# EAGLE design tinyape (EAGLE 9.1.1)
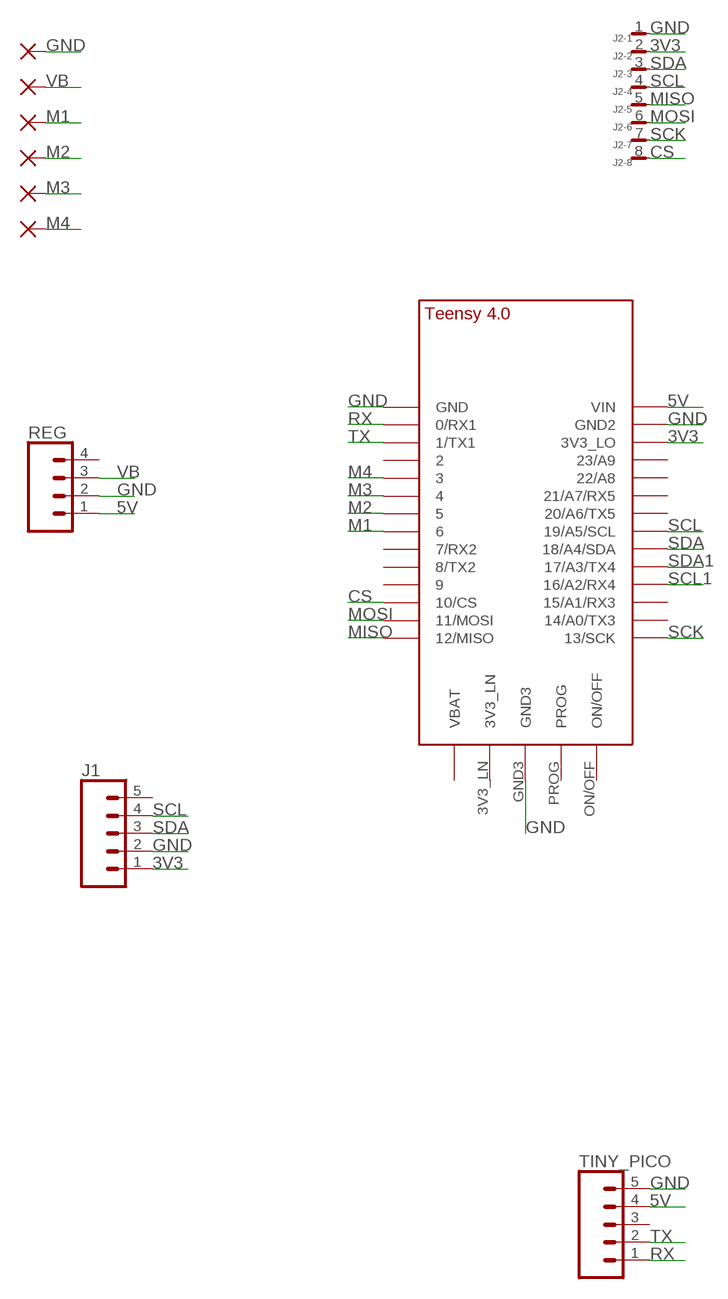
[diagram p0: schematic, sheet 1]

## Parts
GND  SMD2  [SMD1,27-2,54]
J1  CONN_05NO_SILK  [1X05_NO_SILK]
J2  JST-SH-8_RA  [SM08B-SRSS-TB]
M1  SMD2  [SMD1,27-2,54]
M2  SMD2  [SMD1,27-2,54]
M3  SMD2  [SMD1,27-2,54]
M4  SMD2  [SMD1,27-2,54]
REG  CONN_041X04_NO_SILK  [1X04_NO_SILK]
TINY_PICO  CONN_05NO_SILK  [1X05_NO_SILK]
U$1  TEENSY_4.0  [TEENSY_4.0]
VBAT  SMD2  [SMD1,27-2,54]

## Nets
3V3: J1.1 J2.2 U$1.3V3_LO
5V: REG.1 TINY_PICO.4 U$1.VIN
CS: J2.8 U$1.10/CS
GND: GND.1(P) J1.2 J2.1 REG.2 TINY_PICO.5 U$1.GND U$1.GND2 U$1.GND3
M1: M4.1(P) U$1.6
M2: M3.1(P) U$1.5
M3: M2.1(P) U$1.4/CANRX
M4: M1.1(P) U$1.3/CANTX
MISO: J2.5 U$1.12/MISO
MOSI: J2.6 U$1.11/MOSI
RX: TINY_PICO.1 U$1.0/RX(0/RX1)
SCK: J2.7 U$1.13/SCK
SCL: J1.4 J2.4 U$1.19/A5/SCL
SCL1: U$1.16/A2(16/A2/RX4)
SDA: J1.3 J2.3 U$1.18/A4/SDA
SDA1: U$1.17/A3(17/A3/TX4)
TX: TINY_PICO.2 U$1.1/TX(1/TX1)
VB: REG.3 VBAT.1(P)
Unconnected: J1.5 J2.M1 J2.M2 REG.4 TINY_PICO.3 U$1.2 U$1.3V3_LN U$1.7(7/RX2) U$1.8(8/TX2) U$1.9/CS U$1.14/A0(14/A0/TX3) U$1.15/A1(15/A1/RX3) U$1.20/A6(20/A6/TX5) U$1.21/A7(21/A7/RX5) U$1.22/A8 U$1.23/A9 U$1.ON/OFF U$1.PROG U$1.VBAT\(VBAT)

## Library data of the parts
GND M1-M4 VBAT = wirepad:SMD2: SMD PAD
J1 TINY_PICO = SparkFun-Connectors:CONN_05: Multi connection point. Often used as Generic Header-pin footprint for 0.1 inch spaced/style header connections On any of the 0.1 inch spaced packages, you can populate with these: Break Away Headers - Straight <https://www.sparkfun.com/products/116> (PRT-00116) Break Away Male Headers - Right Angle <https://www.sparkfun.com/products/553> (PRT-00553) Female Headers <https://www.sparkfun.com/products/115> (PRT-00115) Break Away Headers - Machine Pin <https://www.sparkfun.com/products/117> (PRT-00117) Break Away Female Headers - Swiss Machine Pin <https://www.sparkfun.com/products/743> (PRT-00743) For SCREWTERMINALS and SPRING TERMINALS visit here: Screw Terimnals on SparkFun.com <https://www.sparkfun.com/search/results?term=Screw+Terminals> (5mm/3.5mm/2.54mm spacing) This device is also useful as a general connection point to wire up your design to another part of your project. Our various solder wires solder well into these plated through hole pads. Hook-Up Wire - Assortment (Stranded, 22 AWG) <https://www.sparkfun.com/products/11375> (PRT-11375) Hook-Up Wire - Assortment (Solid Core, 22 AWG) <https://www.sparkfun.com/products/11367> (PRT-11367) View the entire wire category on our website here <https://www.sparkfun.com/categories/141> Special notes: Molex polarized connector foot print use with SKU : PRT-08231 with associated crimp pins and housings. 1MM SMD Version SKU: PRT-10208
J2 = con-JST-SH:JST-SH-8; MF: JST; MPN: SM08B-SRSS-TB
REG = SparkFun-Connectors:CONN_04: Multi connection point. Often used as Generic Header-pin footprint for 0.1 inch spaced/style header connections On any of the 0.1 inch spaced packages, you can populate with these: Break Away Headers - Straight <https://www.sparkfun.com/products/116> (PRT-00116) Break Away Male Headers - Right Angle <https://www.sparkfun.com/products/553> (PRT-00553) Female Headers <https://www.sparkfun.com/products/115> (PRT-00115) Break Away Headers - Machine Pin <https://www.sparkfun.com/products/117> (PRT-00117) Break Away Female Headers - Swiss Machine Pin <https://www.sparkfun.com/products/743> (PRT-00743) For SCREWTERMINALS and SPRING TERMINALS visit here: Screw Terimnals on SparkFun.com <https://www.sparkfun.com/search/results?term=Screw+Terminals> (5mm/3.5mm/2.54mm spacing) This device is also useful as a general connection point to wire up your design to another part of your project. Our various solder wires solder well into these plated through hole pads. Hook-Up Wire - Assortment (Stranded, 22 AWG) <https://www.sparkfun.com/products/11375> (PRT-11375) Hook-Up Wire - Assortment (Solid Core, 22 AWG) <https://www.sparkfun.com/products/11367> (PRT-11367) View the entire wire category on our website here <https://www.sparkfun.com/categories/141> Special notes: Molex polarized connector foot print use with SKU : PRT-08231 with associated crimp pins and housings. 1MM SMD Version SKU: PRT-10208; PROD_ID: CONN-09696
U$1 = TEENSY 4.0:TEENSY_4.0

## Board
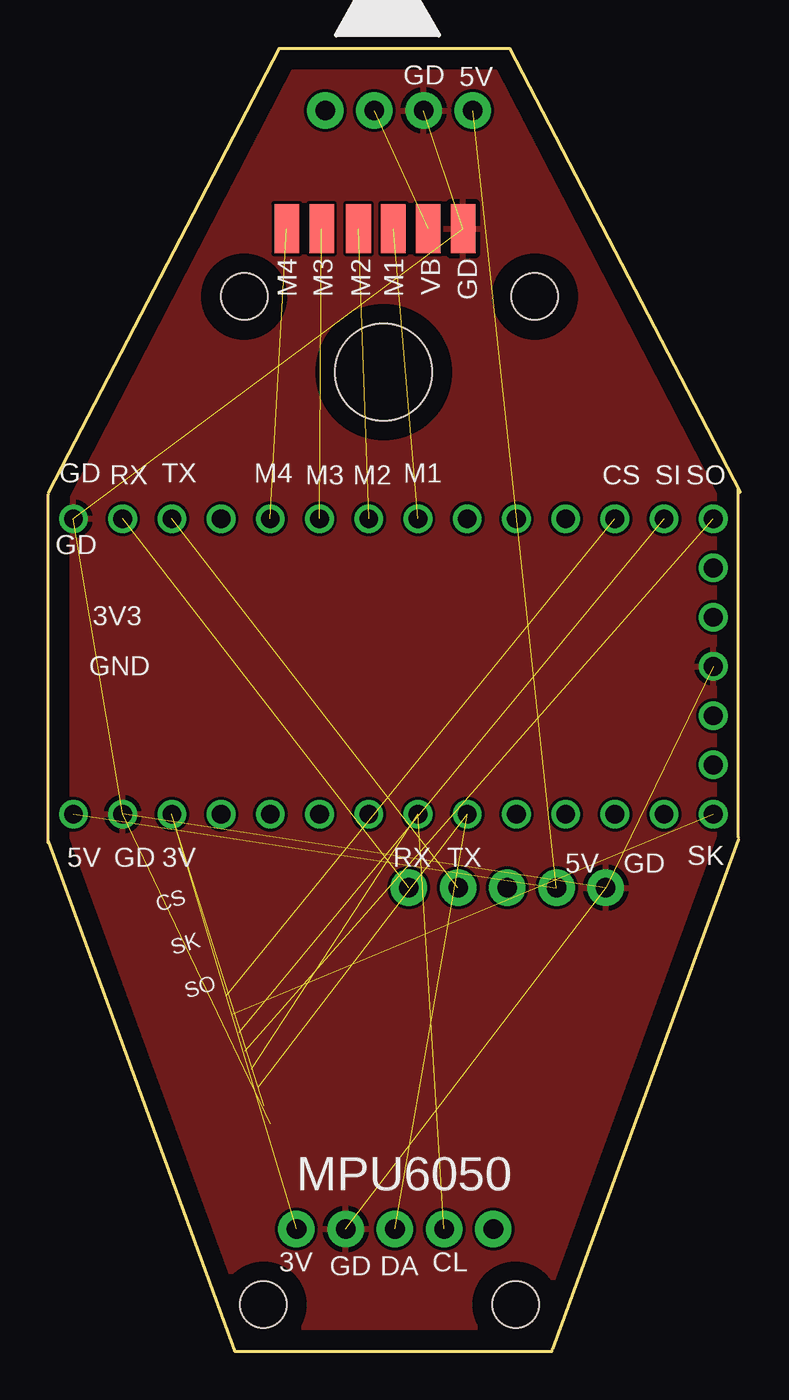
[diagram p1: board, top side]
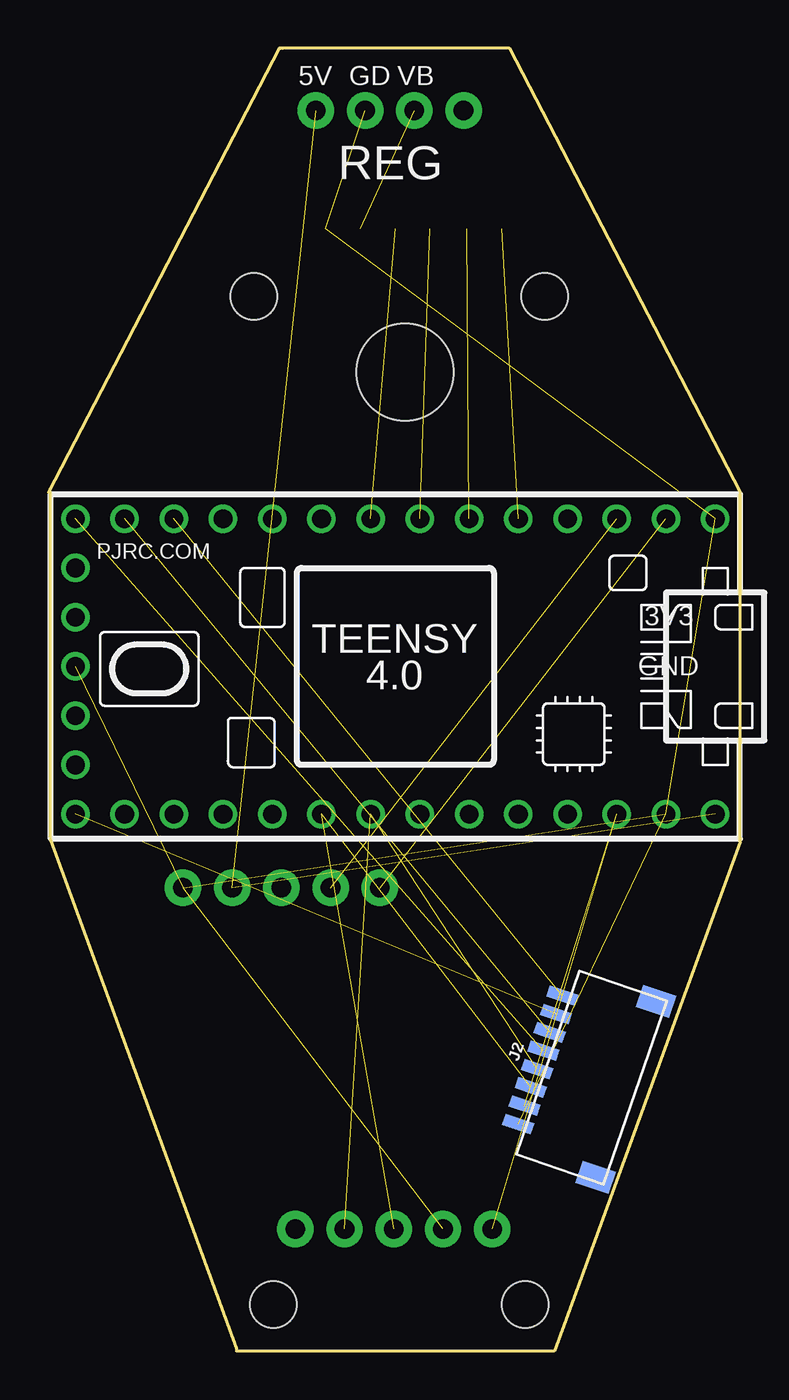
[diagram p2: board, bottom side, seen from below]

Size 35.7 x 67.2 mm. Coordinates in mm from the lower left corner, seen from the top.
Outline: 0,26.3 9.6,0 26,0
Outline: 0,26.2 0,44.2
Outline: 35.6,26.5 35.6,44.5
Outline: 0,44.3 11.9,67.2 23.6,67.2
Outline: 35.7,44.3 23.8,67.2 23.6,67.2
Outline: 23.6,67.2 23.7,67.2
Outline: 35.6,26.4 26,0.1
Copper layers (1*16): Top 0.035mm / dielectric 1.5mm / Bottom 0.035mm
Design rules "default": minimum track width 6mil, minimum drill 0.35mm, track to track 6mil, track to pad 6mil, pad to pad 6mil, via to via 6mil, smd to smd 6mil, copper to edge 40mil, drill to drill 6mil, minimum pad ring 10mil, minimum via ring 8mil, stop-mask expansion 4mil, vias tented up to drill 0mil, thermal gap 10mil
Holes 2.4 mm at 10.1,54.4 25.1,54.4 11.1,2.4 24.1,2.4
Holes 5 mm at 17.3,50.5

### Footprints (pad centres in the part's own frame; a part is rotated, then mirrored left to right if it is on the bottom)
SMD1,27-2,54 = smd 1.27 x 2.54: 1 0,0
1X05_NO_SILK = drill 1.016 pad 1.88: 1 0,0; 2 2.54,0; 3 5.08,0; 4 7.62,0; 5 10.16,0
SM08B-SRSS-TB = smd 0.6 x 1.55: 1 -3.5,4.675; 2 -2.5,4.675; 3 -1.5,4.675; 4 -0.5,4.675; 5 0.5,4.675; 6 1.5,4.675; 7 2.5,4.675; 8 3.5,4.675 | smd 1.2 x 1.8: M1 4.8,0; M2 -4.8,0
1X04_NO_SILK = drill 1.016 pad 1.88: 1 0,0; 2 2.54,0; 3 5.08,0; 4 7.62,0
TEENSY_4.0 = drill 0.965: 0/RX -13.97,-7.62; 1/TX -11.43,-7.62; 2 -8.89,-7.62; 3/CANTX -6.35,-7.62; 3V3_LN 16.51,-2.54; 3V3_LO -11.43,7.62; 4/CANRX -3.81,-7.62; 5 -1.27,-7.62; 6 1.27,-7.62; 7 3.81,-7.62; 8 6.35,-7.62; 9/CS 8.89,-7.62; 10/CS 11.43,-7.62; 11/MOSI 13.97,-7.62; 12/MISO 16.51,-7.62; 13/SCK 16.51,7.62; 14/A0 13.97,7.62; 15/A1 11.43,7.62; 16/A2 8.89,7.62; 17/A3 6.35,7.62; 18/A4/SDA 3.81,7.62; 19/A5/SCL 1.27,7.62; 20/A6 -1.27,7.62; 21/A7 -3.81,7.62; 22/A8 -6.35,7.62; 23/A9 -8.89,7.62; GND -16.51,-7.62; GND2 -13.97,7.62; GND3 16.51,0; ON/OFF 16.51,5.08; PROG 16.51,2.54; VBAT\ 16.51,-5.08; VIN -16.51,7.62

### Placement (x,y rotation side)
GND  21.4,57.9 0 top
J1  12.8,6.3 0 top
J2  5.9,13.5 71 bottom
M1  12.3,57.9 0 top
M2  14.1,57.9 0 top
M3  16,57.9 0 top
M4  17.8,57.9 0 top
REG  21.9,64 180 top
TINY_PICO  18.6,23.9 0 top
U$1  17.8,35.32 180 bottom
VBAT  19.6,57.9 0 top

### Tracks (layer width: path | path; a pad name or v marks a point on that pad's centre or on a via)
3V3  (2 unrouted)
5V  (2 unrouted)
CS  (1 unrouted)
GND  (7 unrouted)
  pour Top: 51.35,76.66 51.35,-4.85 -17.1,-4.85 -17.1,76.66
M1  (1 unrouted)
M2  (1 unrouted)
M3  (1 unrouted)
M4  (1 unrouted)
MISO  (1 unrouted)
MOSI  (1 unrouted)
RX  (1 unrouted)
SCK  (1 unrouted)
SCL  (2 unrouted)
SDA  (2 unrouted)
TX  (1 unrouted)
VB  (1 unrouted)

### Text on the board
tNames: GD | 5V | M4 | M3 | M2 | M1 | VB | GD | GD | RX | TX | M4 | M3 | M2 | M1 | CS | SI | SO | GD | 3V3 | GND | 5V | GD | 3V | RX | TX | SK | 5V | GD | CS | SK | SO | MPU6050 | 3V | CL | GD | DA
bNames: VB | GD | 5V | REG | 3V3 | GND